# Altium schematic sheet MySchematic.SchDoc
size A4; SheetNumber: 1; SheetTotal: 1
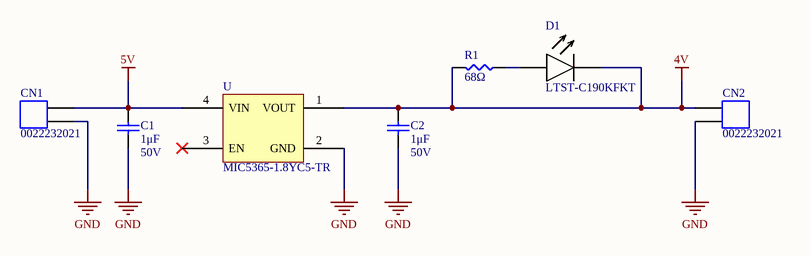
[diagram p0: MySchematic.SchDoc]

## Parts
C1  value 1μF  Voltage Rating: 50V  [CAP0805]  (hidden comment: GCM21BR71E105KA56L_1)
C2  value 1μF  Voltage Rating: 50V  [CAP0805]  (hidden comment: GCM21BR71E105KA56L_1)
CN1  0022232021  [900-0022232021-ND]
CN2  0022232021  [900-0022232021-ND]
D1  LTST-C190KFKT  [0603 (1608 Metric)]
R1  value 68Ω  [RES0603]  (hidden comment: RC0603JR-0768RL)
U  MIC5365-1.8YC5-TR  [576-3181-6-ND]

## Nets
4V: C2.2 CN2.2 D1.2 R1.1 U.1(VOUT)
5V: C1.2 CN1.1 U.4(VIN)
GND: C1.1 C2.1 CN1.2 CN2.1 U.2(GND)
NetD1_1: D1.1 R1.2

Not connected (* = marked no-connect by the designer): U 3(EN)*

## Library data of the parts
C1 C2 = GCM21BR71E105KA56L_1: CAP CER 1PF 50V C0G/NP0 0402; Manufacturer 1: Murata; Manufacturer Part Number 1: GJM1555C1H1R0WB01; Supplier 1: Mouser; Supplier Part Number 1: 81-GJM1555C1H1R0WB1D
CN1 CN2 = 0022232021: CONN HEADER VERT 2POS 2.54MM; Manufacturer 1: Molex; Manufacturer Part Number 1: 0022232021; Supplier 1: DigiKey; Supplier Part Number 1: 900-0022232021-ND
D1 = LTST-C190KFKT: ED ORANGE CLEAR CHIP SMD; Manufacturer 1: Lite-On Inc.; Manufacturer Part Number 1: LTST-C190KFKT; Supplier 1: DigiKey; Supplier Part Number 1: 160-1434-1-ND
R1 = RC0603JR-0768RL: RES 68 OHM 5% 1/10W 0603; Manufacturer 1: YAGEO; Manufacturer Part Number 1: RC0603JR-0768RL; Supplier Part Number 1: 311-68GRCT-ND; Supplier 1: Digi-Key; Power Rating: 1/10W
U = MIC5365-1.8YC5-TR: IC REG LINEAR 1.8V 150MA SC-70-5; Manufacturer 1: Microchip Technology; Manufacturer Part Number 1: *MIC5365-1.8YC5-TR